# Altium schematic sheet 16VPow.SchDoc
size A4; SheetNumber: 11; SheetTotal: 11
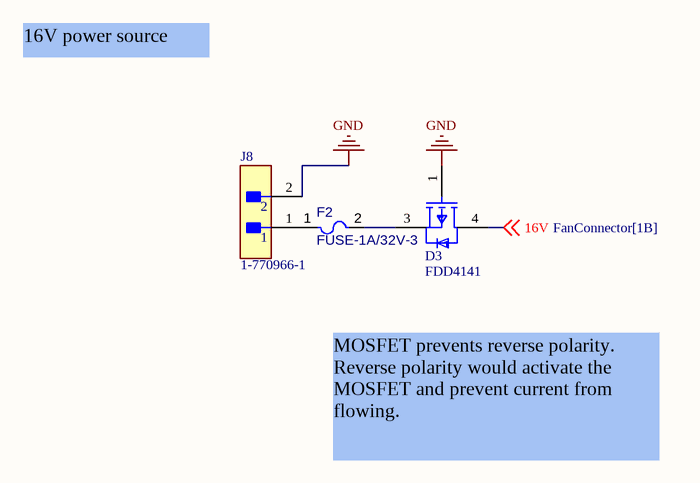
[diagram p0: 16VPow.SchDoc]

## Parts
D3  FDD4141  [FP-369AS-MFG]
F2  FUSE-1A/32V-3  [LFUS-467_V]
J8  1-770966-1  [FP-1-770966-1-MFG]

## Nets
GND: D3.1(G) J8.2
16V: D3.4(D) ; off-sheet 16V
NetD3_3: D3.3(S) F2.2
NetF2_1: F2.1 J8.1

## Notes on the sheet
- 16V power source
- MOSFET prevents reverse polarity. Reverse polarity would activate the MOSFET and prevent current from flowing.

## Library data of the parts
D3 = CMP-07173-000088-1: MOSFET P-CH 40V 10.8A DPAK; Manufacturer: ON Semiconductor; Gate Charge At Vgs: 36nC @ -10V; Transconductance: 38S; Drain To Source Breakdown Voltage: -40V; Reverse Recovery Time: 29ns; Pulse Drain Current: -100A; Reverse Recovery Charge: 26nC; Drain To Source Resistance: 10.1mΩ; Power Dissipation: 2.4W; Max Forward Diode Voltage: -1.2V; Turn Off Delay Time: 38ns; Number Of P Channels: 1; Gate To Source Voltage: 20V; Rthja Max: 52°C/W; Depletion Mode: False; Threshold Vgs Max: -3V; Threshold Vgs Min: -1V; Turn On Delay Time: 10ns; Max Junction Temp: +150°C; Input Capacitace At Vds: 2085pF @ -20V; Continuous Drain Current: -10.8A; Typ Forward Diode Voltage: -0.8V; Package: 369AS; Category: Diode; RoHS: TRUE; Device Class L2: Transistors; Octopart: https://octopart.com/fdd4141-on+semiconductor-84325802; Temperature: -55°C to +150°C; Drain To Source Voltage: -40V; Device Class L1: Discrete Semiconductors; Temperature Range Low: -55°C; Height: 2.517mm; ComponentLink2Description: Datasheet; Automotive: No; Number Of Channels: 1; Digikey Description: MOSFET P-CH 40V 10.8A DPAK; Lead Free: Yes; Manufacturer Part Number: FDD4141; Temperature Range High: +150°C; Footprint Url: https://www.onsemi.com/pub/Collateral/369AS.PDF; Device Class L3: MOSFETs; Mouser Description: MOSFET -40V P-Channel PowerTrench; ComponentLink2URL: https://www.onsemi.com/pub/Collateral/FDD4141-D.pdf
F2 = CMP-005-00012-2: Fast Acting Fuse, 1 A, 32 V, -55 to 90 degC, 2-Pin SMD, RoHS, Tape and Reel; Current Rating: 1A; Case/Package: LFUS-467; Pins: 2
J8 = CMP-03369-000082-1: CONN HEADER R/A 2POS 4.14MM; Manufacturer: TE; Current Rating: 9.5A; Standoff Height: 0.63mm; Conn Gender: Male; Voltage Rating: 600V; Number Of Contacts: 2; Conn Orientation: Right Angle; Device Class L3: unset; Pitch: 4.14mm; Height: 7.9mm; Temperature Range High: +105°C; Octopart: https://octopart.com/1-770966-1-te+connectivity-46506767; Automotive: No; Digikey Description: CONN HEADER R/A 2POS 4.14MM; ComponentLink2URL: https://www.te.com/usa-en/product-1-770966-1.html?te_bu=Cor&te_type=other&te_campaign=oct_glo_cor-oct-global-oth-prtnr-fy19-oct-octo-buy-bom_sma-298_2&elqCampaignId=35216; Category: Conn; Lead Free: Yes; Mouser Description: Pin & Socket Connectors HEADER 2 POS R/A GOLD IN-LINE; ComponentLink2Description: Datasheet; Contact Material: Gold,Tin,Nickel; Device Class L1: Connectors; Number Of Rows: 1; Device Class L2: Headers and Wire Housings; Package: 1-770966-1; RoHS: TRUE; Manufacturer Part Number: 1-770966-1; Temperature: -55°C to +105°C; Temperature Range Low: -55°C